# EAGLE design dc-motor (EAGLE 6.2)
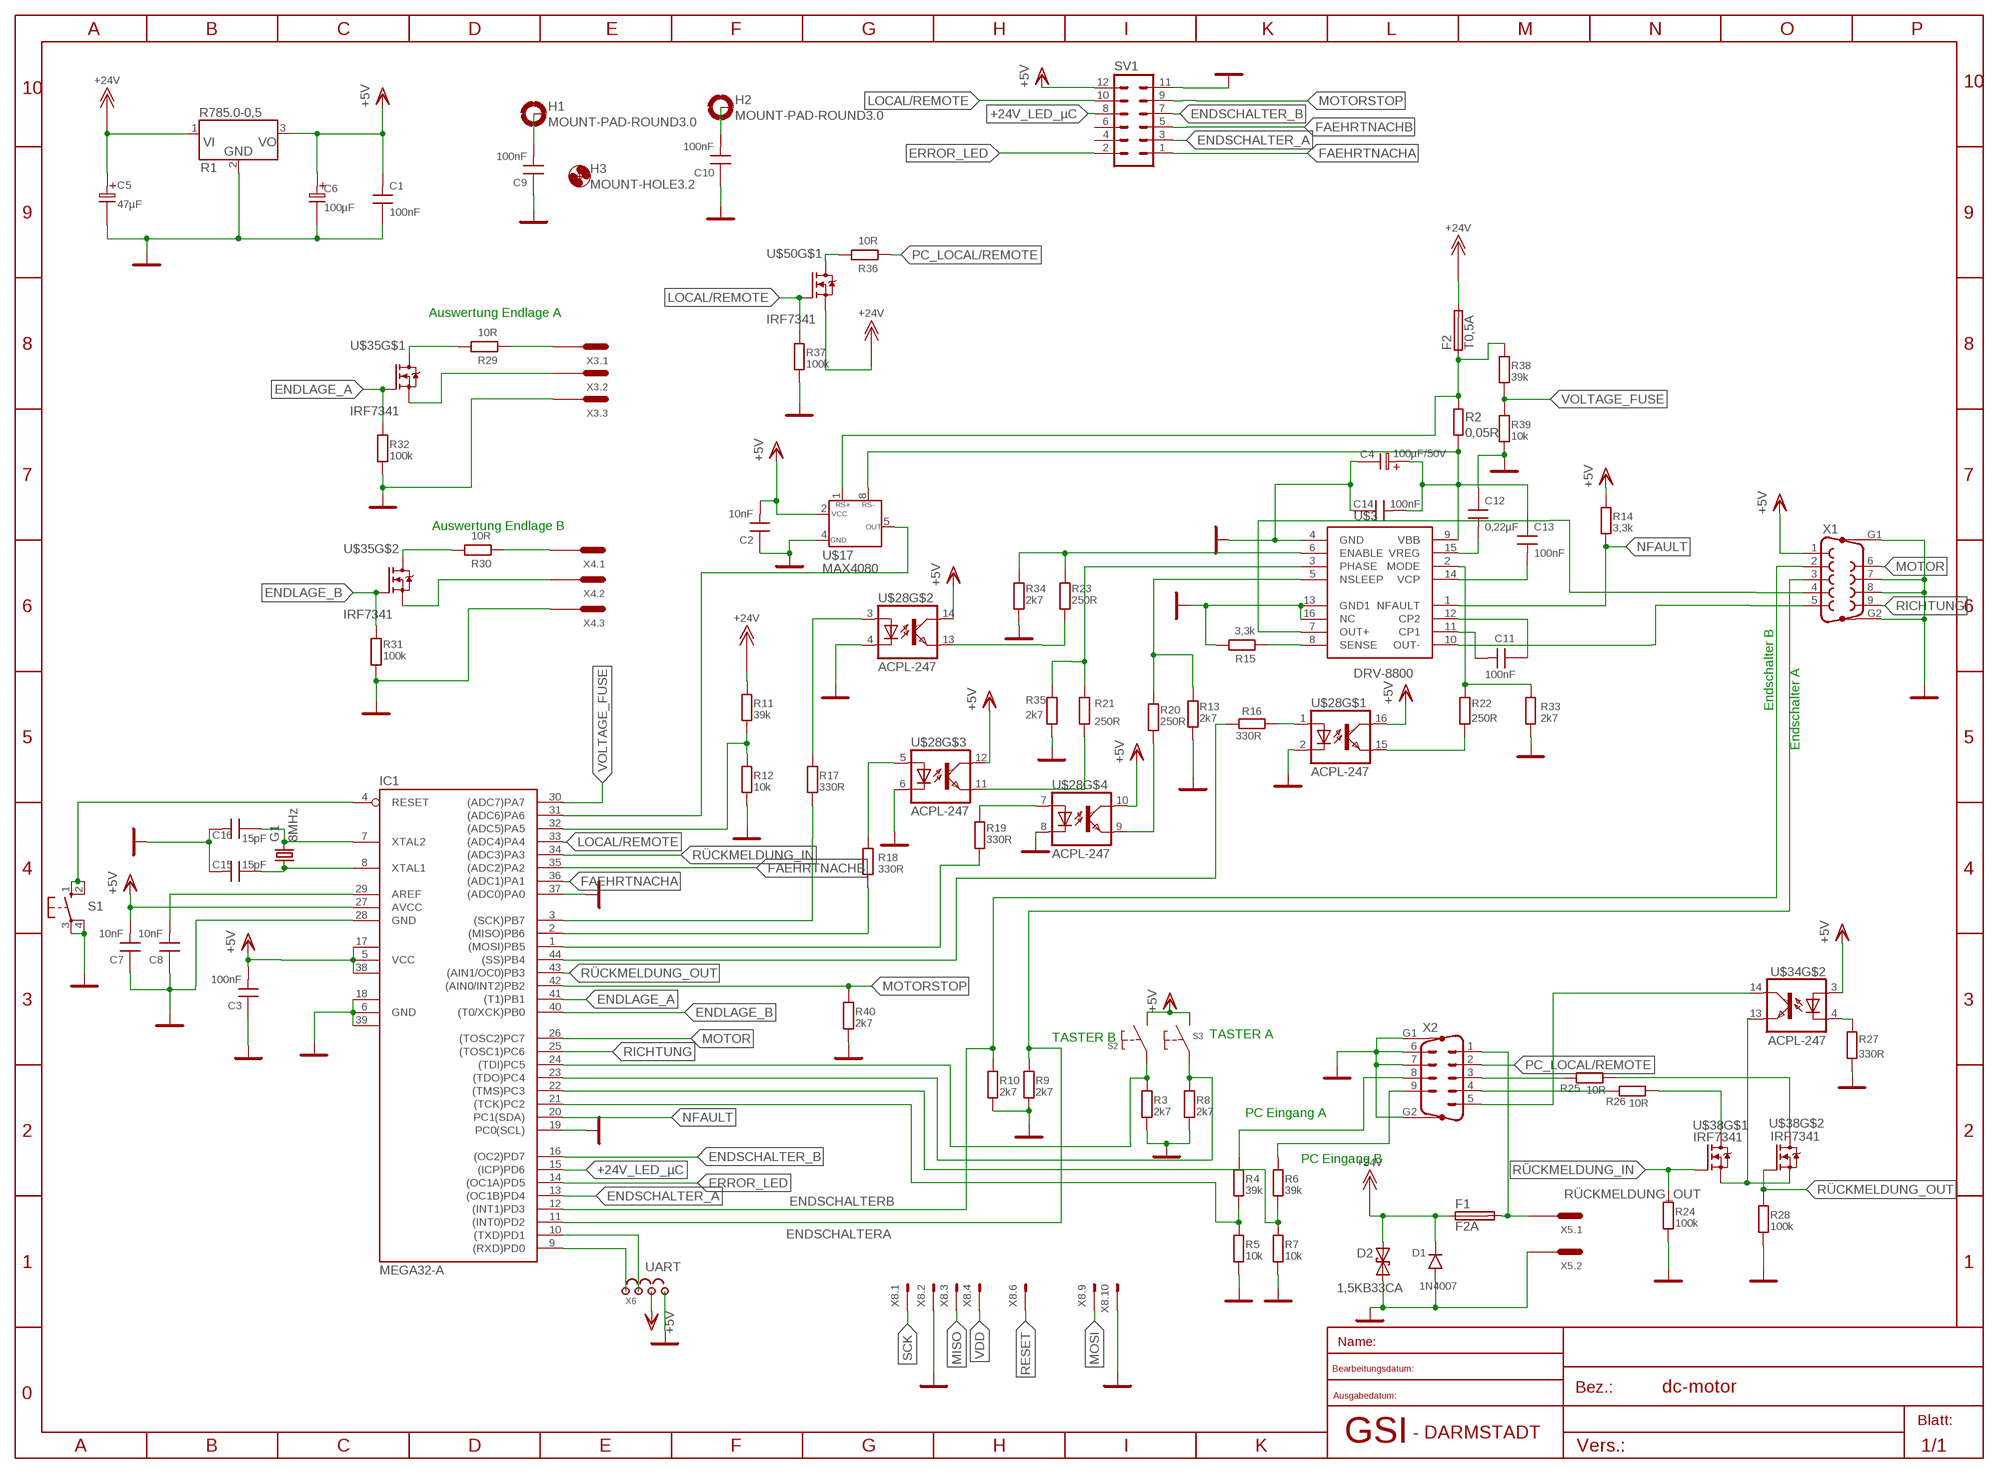
[diagram p0: schematic, sheet 1]

## Parts
C1  100nF  C-BELAB0805  [0805]
C2  10nF  C-BELAB0805  [0805]
C3  100nF  C-BELAB0805  [0805]
C4  100µF/50V  ELK_STEHEND_5_13  [E5-13]
C5  47µF  ELK_STEHEND_5_13  [E5-13]
C6  100µF  ELK_STEHEND_5_13  [E5-13]
C7  10nF  C-BELAB0805  [0805]
C8  10nF  C-BELAB0805  [0805]
C9  100nF  C-BELAB0805  [0805]
C10  100nF  C-BELAB0805  [0805]
C11  100nF  C-BELAB0805  [0805]
C12  0,22µF  C-BELAB0805  [0805]
C13  100nF  C-BELAB0805  [0805]
C14  100nF  C-BELAB0805  [0805]
C15  15pF  C-BELAB0805  [0805]
C16  15pF  C-BELAB0805  [0805]
D1  1N4007  [RM10DR1]
D2  1,5KB33CA  P6KEXXC  [CB417-15]
F1  F2A  F457  [F457]
F2  T0,5A  F457  [F457]
G1  8MHz  CRYTALHC18U-V  [HC18U-V]
H1  MOUNT-PAD-ROUND3.0  [3,0-PAD]
H2  MOUNT-PAD-ROUND3.0  [3,0-PAD]
H3  MOUNT-HOLE3.2  [3,2]
IC1  MEGA32-A  [TQFP44]
R1  R785.0-0,5  R-785.0-0.5  [SIP3]
R2  0,05R  SMS-0  [SMS-0]
R3  2k7  0805  [0805]
R4  39k  0805  [0805]
R5  10k  0805  [0805]
R6  39k  0805  [0805]
R7  10k  0805  [0805]
R8  2k7  0805  [0805]
R9  2k7  0805  [0805]
R10  2k7  0805  [0805]
R11  39k  0805  [0805]
R12  10k  0805  [0805]
R13  2k7  0805  [0805]
R14  3,3k  0805  [0805]
R15  3,3k  0805  [0805]
R16  330R  0805  [0805]
R17  330R  0805  [0805]
R18  330R  0805  [0805]
R19  330R  0805  [0805]
R20  250R  0805  [0805]
R21  250R  0805  [0805]
R22  250R  0805  [0805]
R23  250R  0805  [0805]
R24  100k  0805  [0805]
R25  10R  0805  [0805]
R26  10R  0805  [0805]
R27  330R  0805  [0805]
R28  100k  0805  [0805]
R29  10R  0805  [0805]
R30  10R  0805  [0805]
R31  100k  0805  [0805]
R32  100k  0805  [0805]
R33  2k7  0805  [0805]
R34  2k7  0805  [0805]
R35  2k7  0805  [0805]
R36  10R  0805  [0805]
R37  100k  0805  [0805]
R38  39k  0805  [0805]
R39  10k  0805  [0805]
R40  2k7  0805  [0805]
S1  10-XX  [B3F-10XX]
S2  DRUCKTASTER_ABGW  [1_POL_ABGW]
S3  DRUCKTASTER_ABGW  [1_POL_ABGW]
SV1  MA06-2  [MA06-2]
U$3  DRV-8800  [TSSOP16]
U$17  MAX4080  [MAX4080]
U$28  ACPL-247  [SOIC16]
U$34  ACPL-247  [SOIC16]
U$35  IRF7341  [SO08-IRF]
U$38  IRF7341  [SO08-IRF]
U$50  IRF7341  [SO08-IRF]
X1  F09HP  [F09HP]
X2  M09HP  [M09HP]
X3  RIA_3POL  [RIA_3POL]
X4  RIA_3POL  [RIA_3POL]
X5  RIA_2POL  [RIA_2POL]
X6  JUMP1-4  [JUMP1-4]
X8  PFVERB10  [PFVERB10]

## Nets
+24V: C5.+ D1.K D2.C F1.1 F2.2 R1.1 R11.2 U$50.1(N-S1)
+24V_LED_µC: IC1.15((ICP)PD6) SV1.8
ENDLAGE_A: IC1.41((T1)PB1) R32.1 U$35.2(N-G1)
ENDLAGE_B: IC1.40((T0/XCK)PB0) R31.1 U$35.4(N-G1)
ENDSCHALTER_A: IC1.13((OC1B)PD4) SV1.3
ENDSCHALTER_B: IC1.16((OC2)PD7) SV1.7
ENDSCHALTERA: IC1.11((INT0)PD2) R9.2 X1.3
ENDSCHALTERB: IC1.12((INT1)PD3) R10.2 X1.2
ERROR_LED: IC1.14((OC1A)PD5) SV1.2
FAEHRTNACHA: IC1.36((ADC1)PA1) SV1.1
FAEHRTNACHB: IC1.35((ADC2)PA2) SV1.5
GND: C1.1 C2.1 C3.1 C4.- C5.- C6.- C7.1 C8.1 C9.1 C10.1 C12.1 C14.1 C15.2 C16.2 D1.A D2.A IC1.6(GND) IC1.18(GND1) IC1.19(PC0(SCL)) IC1.28(GND) IC1.37((ADC0)PA0) IC1.39(GND2) R1.2 R3.1 R5.1 R7.1 R8.1 R9.1 R10.1 R12.1 R13.1 R15.2 R24.2 R27.1 R28.2 R31.2 R32.2 R33.1 R34.1 R35.1 R37.2 R39.1 R40.1 S1.3(P) S1.4(P1) SV1.11 U$3.4(GND) U$3.13(GND1) U$3.16(NC) U$17.4(GND) U$28.2(C) U$28.4(C) U$28.6(C) U$28.8(C) X1.7 X1.8 X1.G1 X1.G2 X2.6 X2.7 X2.G1 X2.G2 X3.P$3 X4.P$3 X5.P$2 X6.4 X8.2 X8.10
LOCAL/REMOTE: IC1.33((ADC4)PA4) R37.1 SV1.10 U$50.2(N-G1)
MISO: IC1.2((MISO)PB6) R18.2 X8.3
MOSI: IC1.1((MOSI)PB5) R19.1 X8.9
MOTOR: IC1.26((TOSC2)PC7) X1.6
MOTORSTOP: IC1.42((AIN0/INT2)PB2) R40.2 SV1.9
N$1: F1.2 X2.1 X5.P$1
N$2: C15.1 G1.1 IC1.8(XTAL1)
N$3: C16.1 G1.2 IC1.7(XTAL2)
N$4: IC1.9((RXD)PD0) X6.1
N$6: F2.1 R2.1 R38.2 U$17.1(RS+)
N$7: R18.1 U$28.5(A)
N$8: IC1.10((TXD)PD1) X6.2
N$9: IC1.21((TCK)PC2) R4.1 R5.2
N$10: IC1.31((ADC6)PA6) U$17.5(OUT)
N$11: IC1.22((TMS)PC3) R6.1 R7.2
N$12: R6.2 X2.9
N$13: R4.2 X2.8
N$14: R20.2 U$28.9(EMIT)
N$15: IC1.23((TDO)PC4) R8.2 S3.S1(C)
N$17: IC1.24((TDI)PC5) R3.2 S2.S1(C)
N$19: R19.2 U$28.7(A)
N$20: IC1.32((ADC5)PA5) R11.1 R12.2
N$21: C9.2 H1.B3,0(MOUNT)
N$24: C10.2 H2.B3,0(MOUNT)
N$26: C11.2 U$3.11(CP1)
N$27: C11.1 U$3.12(CP2)
N$28: C12.2 U$3.15(VREG)
N$29: C13.2 U$3.14(VCP)
N$31: R23.1 R34.2 U$3.6(ENABLE)
N$32: C4.+ C13.1 C14.2 R2.2 U$3.9(VBB) U$17.8(RS-)
N$34: R13.2 R20.1 U$3.5(NSLEEP)
N$35: R22.2 U$28.15(EMIT)
N$36: R15.1 U$3.8(SENSE)
N$37: U$34.14(COL) X2.5
N$38: IC1.44((SS)PB4) R16.1
N$39: R36.2 U$50.7(D1) U$50.8(D1)
N$40: R21.1 R35.2 U$3.3(PHASE)
N$41: U$3.7(OUT+) X1.4
N$42: R16.2 U$28.1(A)
N$43: R17.1 U$28.3(A)
N$44: U$3.10(OUT-) X1.5
N$46: R23.2 U$28.13(EMIT)
N$47: R21.2 U$28.11(EMIT)
N$48: R22.1 R33.2 U$3.2(MODE)
N$54: R26.2 X2.4
N$55: R25.2 X2.3
N$58: U$34.13(EMIT) U$38.1(N-S1) U$38.3(N-S1)
N$59: R25.1 U$38.5(D1) U$38.6(D1)
N$60: C8.2 IC1.29(AREF)
N$61: R27.2 U$34.4(C)
N$62: R26.1 U$38.7(D1) U$38.8(D1)
N$67: R29.1 X3.P$1
N$68: R30.1 X4.P$1
N$69: R30.2 U$35.5(D1) U$35.6(D1)
N$70: U$35.3(N-S1) X4.P$2
N$71: R29.2 U$35.7(D1) U$35.8(D1)
N$72: U$35.1(N-S1) X3.P$2
NFAULT: IC1.20(PC1(SDA)) R14.1 U$3.1(NFAULT)
PC_LOCAL/REMOTE: R36.1 X2.2
RESET: IC1.4(RESET) S1.1(S) S1.2(S1) X8.6
RICHTUNG: IC1.25((TOSC1)PC6) X1.9
RÜCKMELDUNG_IN: IC1.34((ADC3)PA3) R24.1 U$38.2(N-G1)
RÜCKMELDUNG_OUT: IC1.43((AIN1/OC0)PB3) R28.1 U$38.4(N-G1)
SCK: IC1.3((SCK)PB7) R17.2 X8.1
VDD: C1.2 C2.2 C3.2 C6.+ C7.2 IC1.5(VCC) IC1.17(VCC1) IC1.27(AVCC) IC1.38(VCC2) R1.3 R14.2 S2.S2(N0) S3.S2(N0) SV1.12 U$17.2(VCC) U$28.10(COL) U$28.12(COL) U$28.14(COL) U$28.16(COL) U$34.3(A) X1.1 X6.3 X8.4 ; supply symbol labelled +5V
VOLTAGE_FUSE: IC1.30((ADC7)PA7) R38.1 R39.2
Unconnected: SV1.4 SV1.6 U$34.1(A) U$34.2(C) U$34.5(A) U$34.6(C) U$34.7(A) U$34.8(C) U$34.9(EMIT) U$34.10(COL) U$34.11(EMIT) U$34.12(COL) U$34.15(EMIT) U$34.16(COL) U$50.3(N-S1) U$50.4(N-G1) U$50.5(D1) U$50.6(D1) X8.5 X8.7 X8.8

## Notes on the sheet
- Auswertung Endlage A
- Auswertung Endlage B
- Endschalter B
- Endschalter A
- TASTER B | TASTER A
- PC Eingang A
- PC Eingang B
- UART

## Library data of the parts
C1-C3 C7-C16 = Capacitor:C-BELAB
C4-C6 = Capacitor:ELK_STEHEND_5_13
D1 = Diode:1N4007
D2 = Diode:P6KEXXC: DIODE transient-voltage suppressor
F1 F2 = fuse:F457: FUSE HOLDER CS, Schukat; OC_FARNELL: unknown; OC_NEWARK: unknown
G1 = Crystals:CRYTAL: Quarze, teilw. geändert für Belab
H1 H2 = Holes:MOUNT-PAD-ROUND: MOUNTING PAD, round
H3 = Holes:MOUNT-HOLE: MOUNTING HOLE with drill center marker
IC1 = atmel:MEGA32: MICROCONTROLLER 32 Kbytes FLASH 2 Kbytes SRAM 1 Kbytes EEPROM USART 8-channel 10 bit ADC Source: www.atmel.com .. doc2503.pdf; MPN: ATMEGA32-16AU; OC_FARNELL: 9171274; OC_NEWARK: 69K6677
R1 = DC-DC-converter:R-785.0-0.5: DC-DC-Converter R-785.0-0.5 Ue/Ua 6.5-34V/ 5V 0.5A
R2 = Resistor:SMS-0: SMD SHUNT RESISTOR Hersteller: Isabellenhütte einsetzbar als Zwei-Leiter-Widerstand, Vier-Leiter-Anbindung auf dem Lötpad. Ideal geeignet für getaktete Applikationen zufolge niedriger Induktivität. Maße: L 6,35, B 3,05, H 0,7 mm, Nennbelastbarkeit: 2,0 W, Temperaturkoeffizient (TK): 50 (+20 bis +60 °C), innerer Wärmewiderstand: 25 K/W, Betriebstemperatur: ?55 bis +170 °C, Langzeitkonstanz +100 °C: 0,5 %/2000 h.
R3-R40 = Resistor:0805: SMD Widerstand
S1 = Switch:10-XX: OMRON SWITCH
S2 S3 = Switch:DRUCKTASTER
SV1 = con-lstb:MA06-2: PIN HEADER; OC_FARNELL: unknown; OC_NEWARK: unknown
U$3 = DRV-8800:DRV-8800
U$17 = Sensorics:MAX4080: MAX4080 Stromsensor 4,5V - 76V / 75µA
U$28 U$34 = Optoelectronic:ACPL-247
U$35 U$38 U$50 = Transistor:IRF7341
X1 = con-subd:F09HP: SUB-D; OC_FARNELL: unknown; OC_NEWARK: unknown
X2 = con-subd:M09HP: SUB-D; OC_FARNELL: unknown; OC_NEWARK: unknown
X3 X4 = Connector:RIA_3POL: RIA AKL230 Reichelt
X5 = Connector:RIA_2POL: RIA AKL230 Reichelt
X6 = Connector:JUMP1-4
X8 = Connector:PFVERB10

## Board
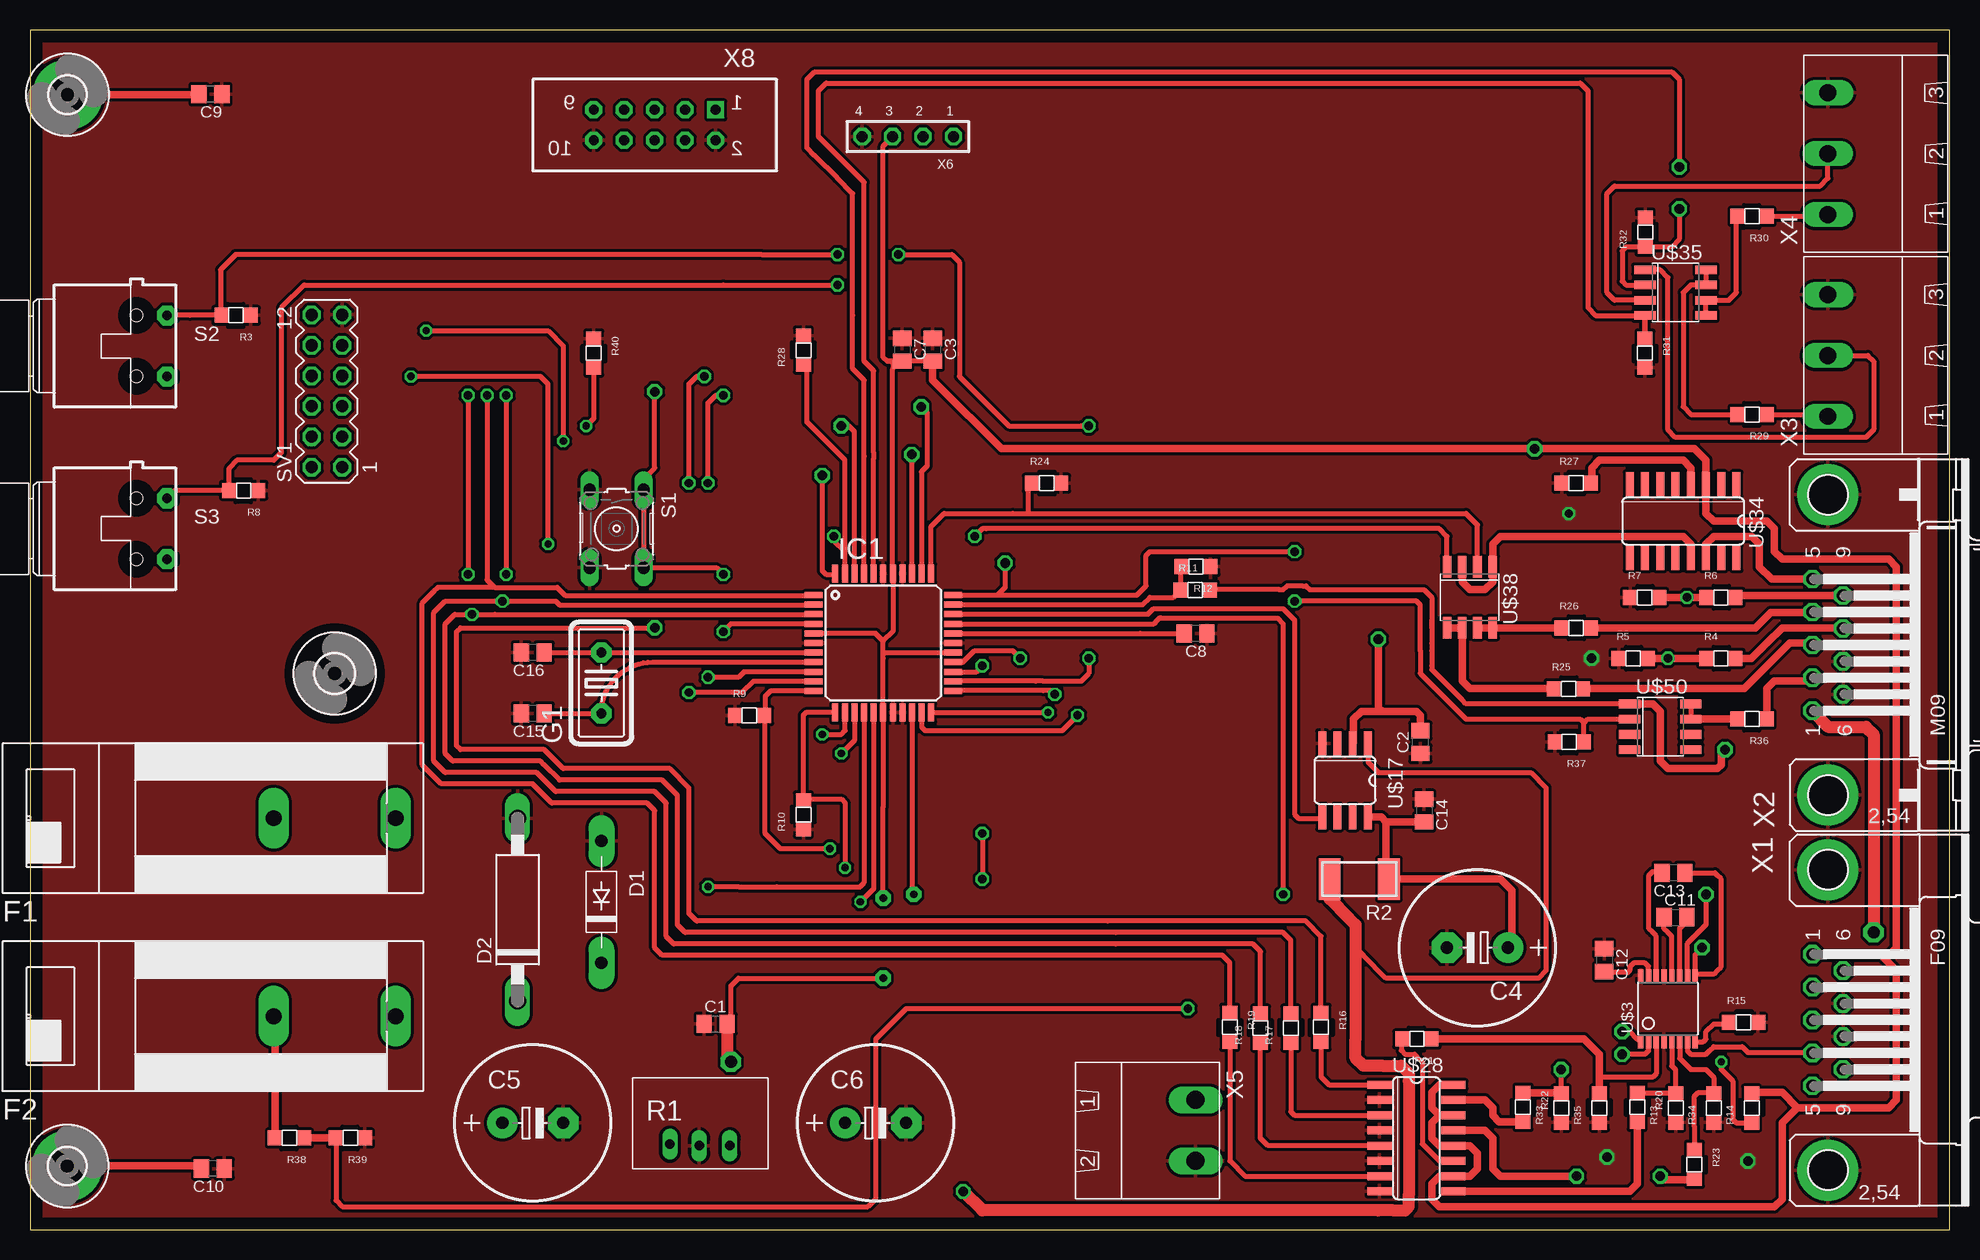
[diagram p1: board, top side]
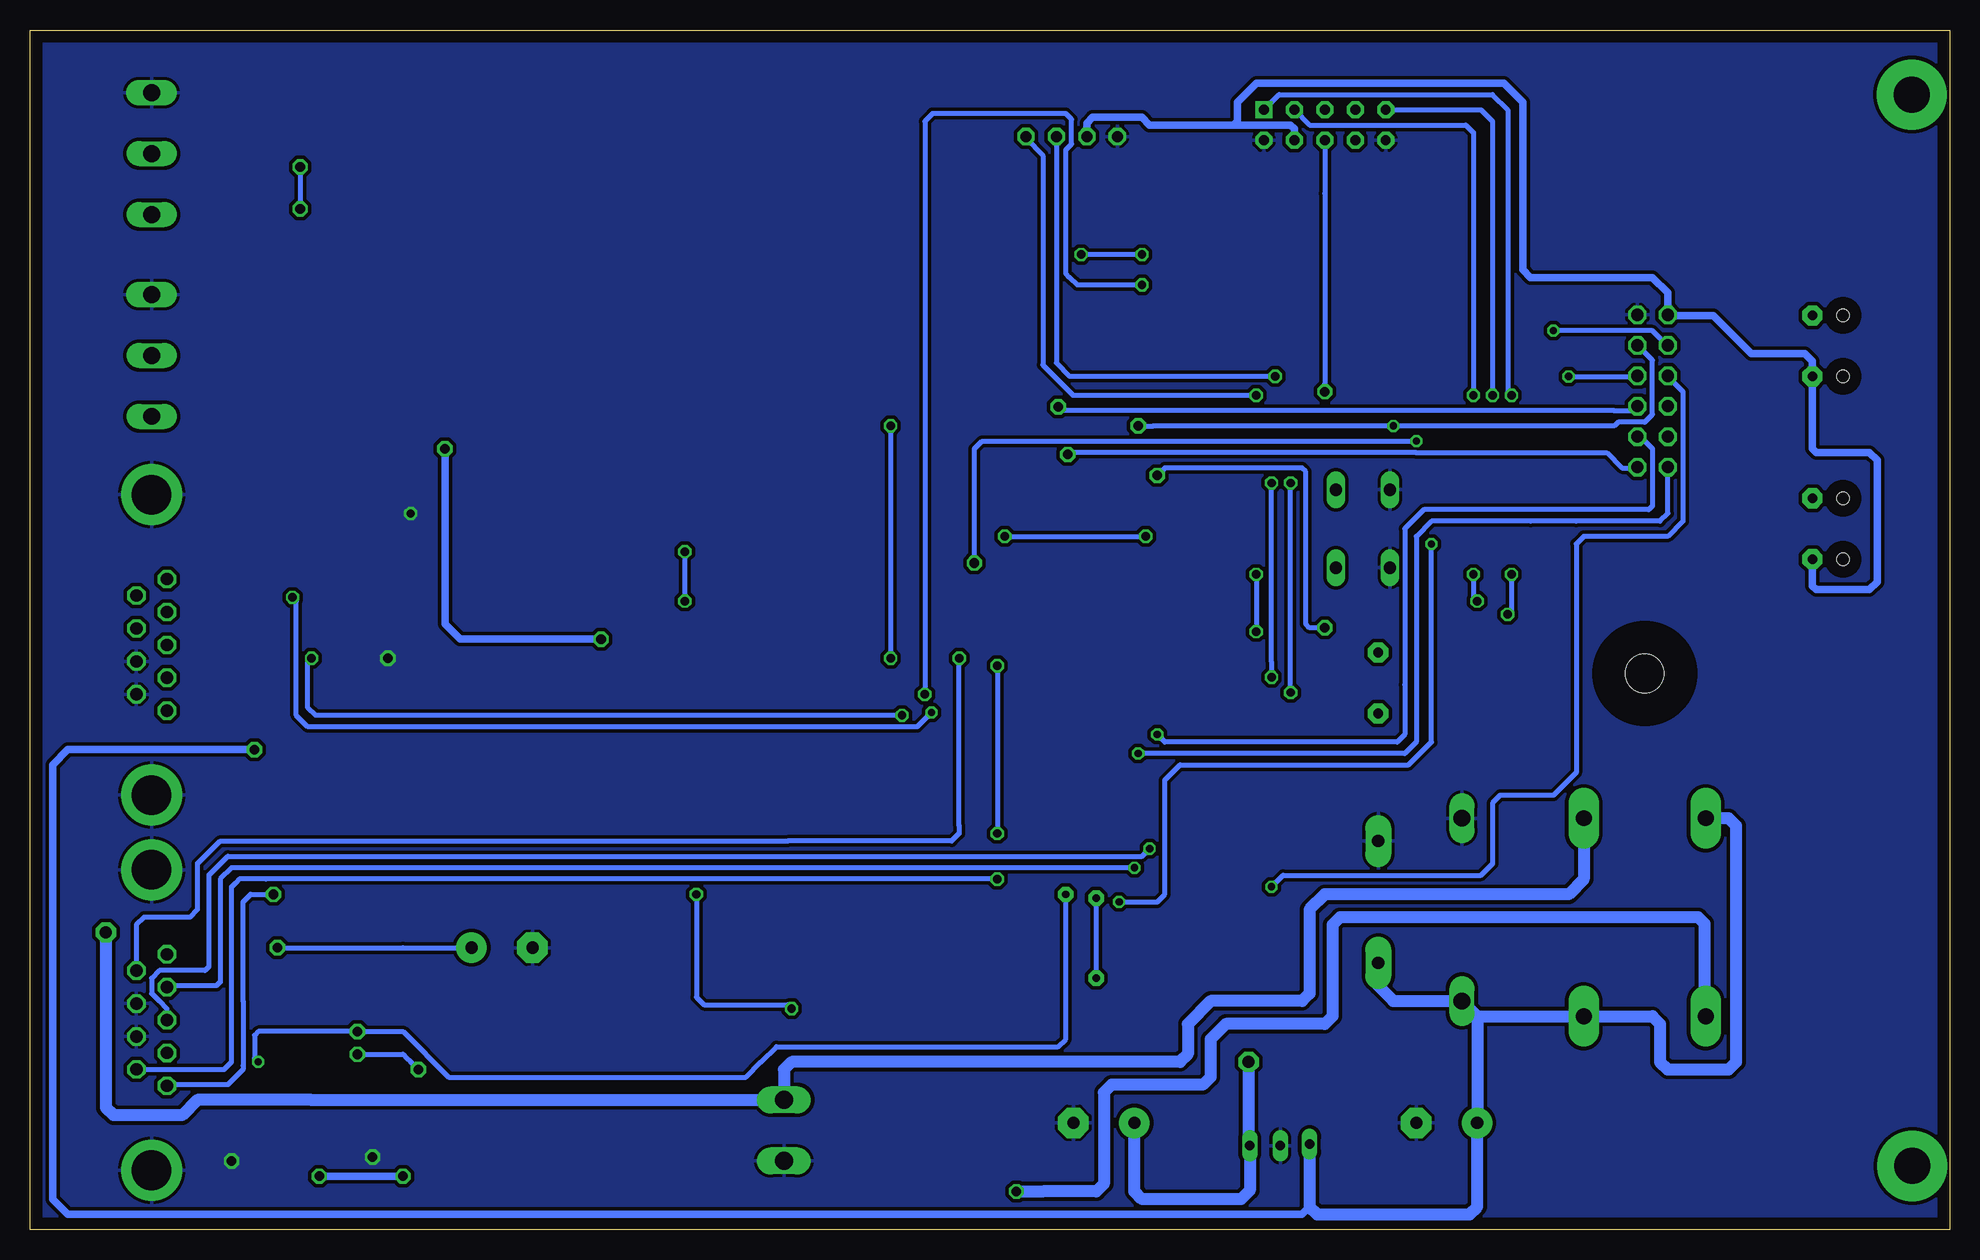
[diagram p2: board, bottom side, seen from below]

Size 160 x 100 mm. Coordinates in mm from the lower left corner, seen from the top.
Outline: 0,0 160,0 160,100 0,100 0,0
Copper layers (1+16): Top 0.035mm / dielectric 1.5mm / Bottom 0.035mm
Design rules: minimum track width 0.304mm, minimum drill 0.3mm, track to track 10mil, track to pad 10mil, pad to pad 10mil, via to via 10mil, smd to smd 8mil, copper to edge 40mil, drill to drill 20mil, minimum pad ring 10mil, minimum via ring 8mil, stop-mask expansion 4mil, vias tented up to drill 0mil, thermal gap 10mil

### Footprints (pad centres in the part's own frame; a part is rotated, then mirrored left to right if it is on the bottom)
0805 = smd 1.27 x 1.524: 1 -0.953,0; 2 0.953,0
E5-13 = drill 1.016 pad 2.54: + -2.54,0 | drill 1.016 pad 2.54 octagon: - 2.54,0
RM10DR1 = drill 1.016 pad 2.184 long: A -6.35,0; K 3.81,0
CB417-15 = drill 1.397 long: A 7.62,0; C -7.62,0
F457 = drill 1.321 pad 2.54 long: 1 -5.08,0; 2 5.08,0
HC18U-V = drill 0.813 pad 1.676 octagon: 1 -2.54,0; 2 2.54,0
3,0-PAD = drill 3 pad 5.842: B3,0 0,0
3,2 = hole 3.2: 0,0
TQFP44 = smd 1.5 x 0.5: 1 -5.8,4; 2 -5.8,3.2; 3 -5.8,2.4; 4 -5.8,1.6; 5 -5.8,0.8; 6 -5.8,0; 7 -5.8,-0.8; 8 -5.8,-1.6; 9 -5.8,-2.4; 10 -5.8,-3.2; 11 -5.8,-4; 23 5.8,-4; 24 5.8,-3.2; 25 5.8,-2.4; 26 5.8,-1.6; 27 5.8,-0.8; 28 5.8,0; 29 5.8,0.8; 30 5.8,1.6; 31 5.8,2.4; 32 5.8,3.2; 33 5.8,4 | smd 0.5 x 1.5: 12 -4,-5.8; 13 -3.2,-5.8; 14 -2.4,-5.8; 15 -1.6,-5.8; 16 -0.8,-5.8; 17 0,-5.8; 18 0.8,-5.8; 19 1.6,-5.8; 20 2.4,-5.8; 21 3.2,-5.8; 22 4,-5.8; 34 4,5.8; 35 3.2,5.8; 36 2.4,5.8; 37 1.6,5.8; 38 0.8,5.8; 39 0,5.8; 40 -0.8,5.8; 41 -1.6,5.8; 42 -2.4,5.8; 43 -3.2,5.8; 44 -4,5.8
SIP3 = drill 0.8 long: 1 0,2.035; 2 2.445,1.905; 3 4.985,1.905
SMS-0 = smd 1.8 x 3.45: 1 2.464,0; 2 -2.464,0
0805' = smd 1.2 x 1.25: 1 -0.601,0.625; 2 1.801,0.625
B3F-10XX = drill 1.016 long: 1 -3.251,2.261; 2 3.251,2.261; 3 -3.251,-2.261; 4 3.251,-2.261
1_POL_ABGW = drill 0.8 pad 1.676 octagon: S1 6.35,2.54; S2 6.35,-2.54 | hole 1.016: 3.81,-2.54; 3.81,2.54
MA06-2 = drill 1.016 octagon: 1 -6.35,-1.27; 2 -6.35,1.27; 3 -3.81,-1.27; 4 -3.81,1.27; 5 -1.27,-1.27; 6 -1.27,1.27; 7 1.27,-1.27; 8 1.27,1.27; 9 3.81,-1.27; 10 3.81,1.27; 11 6.35,-1.27; 12 6.35,1.27
TSSOP16 = smd 0.45 x 1.05: 1 -2.275,-2.768; 2 -1.625,-2.768; 3 -0.975,-2.768; 4 -0.325,-2.768; 5 0.325,-2.768; 6 0.975,-2.768; 7 1.625,-2.768; 8 2.275,-2.768; 9 2.275,2.768; 10 1.625,2.768; 11 0.975,2.768; 12 0.325,2.768; 13 -0.325,2.768; 14 -0.975,2.768; 15 -1.625,2.768; 16 -2.275,2.768
MAX4080 = smd 0.66 x 2.032: 1 -1.667,-3.057; 2 -0.397,-3.057; 3 0.873,-3.057; 4 2.143,-3.057; 5 2.143,3.089; 6 0.873,3.089; 7 -0.397,3.089; 8 -1.667,3.089
SOIC16 = smd 0.66 x 2.032: 1 -4.445,-3.073; 2 -3.175,-3.073; 3 -1.905,-3.073; 4 -0.635,-3.073; 5 0.635,-3.073; 6 1.905,-3.073; 7 3.175,-3.073; 8 4.445,-3.073; 9 4.445,3.073; 10 3.175,3.073; 11 1.905,3.073; 12 0.635,3.073; 13 -0.635,3.073; 14 -1.905,3.073; 15 -3.175,3.073; 16 -4.445,3.073
SO08-IRF = smd 0.72 x 1.78: 1 -1.905,-2.543; 2 -0.635,-2.543; 3 0.635,-2.543; 4 1.905,-2.543; 5 1.905,2.543; 6 0.635,2.543; 7 -0.635,2.543; 8 -1.905,2.543
F09HP = drill 1.016 octagon: 1 -5.486,-1.27; 2 -2.743,-1.27; 3 0,-1.27; 4 2.743,-1.27; 5 5.486,-1.27; 6 -4.115,1.27; 7 -1.372,1.27; 8 1.372,1.27; 9 4.115,1.27 | drill 3.302 pad 5.08: G1 -12.522,0; G2 12.522,0
M09HP = drill 1.016 octagon: 1 -5.486,1.27; 2 -2.743,1.27; 3 0,1.27; 4 2.743,1.27; 5 5.486,1.27; 6 -4.115,-1.27; 7 -1.372,-1.27; 8 1.372,-1.27; 9 4.115,-1.27 | drill 3.302 pad 5.08: G1 -12.522,0; G2 12.522,0
RIA_3POL = drill 1.4 long: P$1 -8.89,7.62; P$2 -3.81,7.62 | drill 1.422 long: P$3 1.27,7.62
RIA_2POL = drill 1.5 long: P$1 -2.54,0; P$2 2.54,0
JUMP1-4 = drill 0.914 pad 1.422 octagon: 1 -3.81,0; 2 -1.27,0; 3 1.27,0; 4 3.81,0
PFVERB10 = drill 0.813 pad 1.422 square: 1 -5.08,-1.27 | drill 0.813 pad 1.422 octagon: 2 -5.08,1.27; 3 -2.54,-1.27; 4 -2.54,1.27; 5 0,-1.27; 6 0,1.27; 7 2.54,-1.27; 8 2.54,1.27; 9 5.08,-1.27; 10 5.08,1.27

### Placement (x,y rotation side)
C1  57.15,17.14 0 top
C2  115.89,40.64 90 top
C3  75.25,73.34 270 top
C4  120.65,23.5 180 top
C5  41.91,8.89 0 top
C6  70.48,8.89 0 top
C7  72.71,73.34 270 top
C8  97.16,49.69 180 top
C9  15.04,94.65 180 top
C10  15.24,5.08 180 top
C11  137.16,26.04 0 top
C12  131.22,22.45 270 top
C13  136.99,29.73 180 top
C14  116.2,34.92 270 top
C15  41.91,43.02 180 top
C16  41.91,48.1 180 top
D1  47.62,26.04 270 top
D2  40.64,26.67 90 top
F1  25.4,34.29 0 top
F2  25.4,17.78 0 top
G1  47.62,45.56 90 top
H1  3.13,94.61 0 top
H2  3.1,5.29 0 top
H3  25.4,46.35 0 top
IC1  71.12,48.9 0 top
R1  53.34,5.08 0 top
R2  110.81,29.21 180 top
R3  2k7  [0805']  17.78,76.83 180 top
R4  39k  [0805']  140.34,46.99 0 top
R5  10k  [0805']  133.03,46.99 0 top
R6  39k  [0805']  140.34,52.07 0 top
R7  10k  [0805']  133.99,52.07 0 top
R8  2k7  [0805']  18.41,62.23 180 top
R9  2k7  [0805']  59.37,42.23 0 top
R10  2k7  [0805']  65.09,33.97 90 top
R11  39k  [0805']  96.52,52.7 0 top
R12  10k  [0805']  97.79,55.88 180 top
R13  2k7  [0805']  137.79,9.53 90 top
R14  3,3k  [0805']  144.15,9.53 90 top
R15  3,3k  [0805']  142.24,16.63 0 top
R16  330R  [0805']  107,17.46 270 top
R17  330R  [0805']  105.73,16.19 90 top
R18  330R  [0805']  103.19,16.19 90 top
R19  330R  [0805']  99.38,17.46 270 top
R20  250R  [0805']  133.35,10.79 270 top
R21  250R  [0805']  116.2,16.51 180 top
R22  250R  [0805']  123.83,10.79 270 top
R23  250R  [0805']  138.11,6.03 270 top
R24  100k  [0805']  84.14,61.59 0 top
R25  10R  [0805']  127.64,44.45 0 top
R26  10R  [0805']  128.27,49.53 0 top
R27  330R  [0805']  128.27,61.59 0 top
R28  100k  [0805']  65.09,72.71 90 top
R29  10R  [0805']  144.15,68.58 180 top
R30  10R  [0805']  144.15,85.09 180 top
R31  100k  [0805']  133.99,73.66 270 top
R32  100k  [0805']  135.25,82.55 90 top
R33  2k7  [0805']  128.27,9.53 90 top
R34  2k7  [0805']  140.97,9.53 90 top
R35  2k7  [0805']  131.44,9.53 90 top
R36  10R  [0805']  144.15,43.18 180 top
R37  100k  [0805']  128.91,41.27 180 top
R38  39k  [0805']  22.23,8.26 180 top
R39  10k  [0805']  27.3,8.26 180 top
R40  2k7  [0805']  46.35,73.66 270 top
S1  48.9,58.42 270 top
S2  5.08,73.66 0 top
S3  5.08,58.42 0 top
SV1  24.74,69.9 90 top
U$3  136.53,18.41 0 top
U$17  109.86,37.47 180 top
U$28  115.57,7.62 270 top
U$34  137.79,59.05 180 top
U$35  137.16,78.11 270 top
U$38  120.02,52.7 180 top
U$50  135.89,41.91 270 top
X1  149.86,17.46 270 top
X2  149.86,48.74 90 top
X3  157.48,76.68 90 top
X4  157.48,93.5 90 top
X5  97.16,8.26 270 top
X6  73.18,91.12 180 top
X8  52.07,92.08 180 top

### Tracks (layer width: path | path; a pad name or v marks a point on that pad's centre or on a via)
+24V  (via drill 0.8 pad 1.27)
  Top 0.406: 116.84,50.16 116.84,50.8 | U$50.1 124.78,43.81 119.7,43.81 119.38,44.13 118.43,45.09 117.79,45.72 116.84,46.67 116.84,46.99 116.84,48.26 116.84,48.9 116.84,50.16 | 116.84,50.16 116.84,52.7 116.22,53.33 106.69,53.33 106.68,53.34 106.36,53.66 106.05,53.66 104.78,53.66 104.46,53.34 104.14,53.34 98.33,53.34 R11.2
  Top 0.61: U$50.1 135.25,43.81 135.89,43.18 135.89,39.05 136.53,38.42 140.65,38.42 140.97,38.73 140.97,39.69 v141.29,40.01
  Bottom 0.61: 143.19,40.01 v141.29,40.01 143.19,40.01 | 143.19,40.01 156.84,40.01 158.12,38.73 158.12,2.54 156.84,1.27 53.98,1.27 53.34,1.91 R1.1
  Bottom 1.016: R1.1 53.34,1.91 52.7,1.27 40.01,1.27 39.37,1.91 C5.+ 39.37,17.78 | D1.K 47.62,20.32 46.35,19.05 D2.C 39.37,17.78 | 39.37,17.78 F2.2 24.77,17.78 24.13,17.14 24.13,13.97 23.5,13.34 18.41,13.34 17.78,13.97 17.78,33.66 18.41,34.29 F1.1
+24V_LED_µC  (via drill 0.6)
  Top 0.406: IC1.15 69.52,28.91 69.22,28.6 69.22,28.57 62.23,28.57 59.05,28.57 v56.52,28.57
  Bottom 0.406: SV1.8 23.47,71.1 22.23,69.85 22.23,59.05 23.5,57.78 30.48,57.78 31.11,57.15 31.11,38.1 33.02,36.2 37.47,36.2 38.1,35.56 38.1,30.48 38.73,29.84 39.05,29.53 55.56,29.53 v56.52,28.57
ENDLAGE_A  (via drill 0.8 pad 1.27)
  Top 0.406: IC1.41 69.52,64.44 69.53,64.45 69.53,70.8 69.22,71.12 68.58,71.75 68.58,76.2 68.58,86.36 67.31,87.63 65.41,89.53 64.77,90.17 64.77,95.89 65.41,96.52 136.84,96.52 137.48,95.89 v137.48,88.58 | v137.48,85.09 137.48,82.55 136.84,81.92 134.66,81.92 | 134.66,81.92 R32.1 | 134.66,81.92 133.03,81.92 132.72,81.6 132.72,79.06 133.03,78.74 U$35.2
  Bottom 0.406: v137.48,88.58 v137.48,85.09
ENDLAGE_B
  Top 0.406: R31.1 U$35.4 130.49,76.2 129.86,76.83 129.86,94.61 129.86,94.93 129.22,95.57 66.36,95.57 65.72,94.93 65.72,91.12 66.36,90.49 68.26,88.58 69.53,87.31 69.53,72.39 70.33,71.6 70.33,64.77 70.33,64.29 70.32,64.29 IC1.40 | R31.1 | R31.1 U$35.4
ENDSCHALTER_A  (via drill 0.6)
  Top 0.406: v66.04,41.27 67.63,41.27 67.94,41.59 67.94,43.07 IC1.13
  Bottom 0.406: SV1.3 25.77,66.09 24.77,65.09 24.77,60.33 25.08,60.01 43.81,60.01 45.4,58.42 45.4,45.4 45.4,41.27 46.04,40.64 65.41,40.64 v66.04,41.27
ENDSCHALTER_B  (via drill 0.6)
  Top 0.406: IC1.16 70.32,28.41 69.85,27.94 v69.22,27.3 | v43.18,57.15 43.18,63.5 43.18,70.48 42.55,71.12 v31.75,71.12
  Bottom 0.406: v69.22,27.3 66.04,27.3 65.41,27.94 65.41,37.47 64.14,38.73 45.09,38.73 43.18,40.64 v43.18,57.15 | v31.75,71.12 26.07,71.12 SV1.7
ENDSCHALTERA  (via drill 0.6)
  Top 0.406: IC1.11 61.72,44.9 61.28,44.45 61.28,42.96 R9.2 61.28,42.75 61.28,33.02 62.55,31.75 v66.67,31.75
  Bottom 0.406: v66.67,31.75 67.31,31.11 143.51,31.11 145.1,29.53 145.1,21.91 145.41,21.59 149.22,21.59 149.86,20.95 149.86,19.68 149.22,19.05 148.59,18.41 X1.3
ENDSCHALTERB  (via drill 0.6)
  Top 0.406: 64.69,43.09 IC1.12 64.69,43.09 | 64.69,43.09 64.45,42.86 | 64.45,42.86 64.45,35.78 R10.2 | 64.69,43.09 64.45,42.86 | 64.45,42.86 64.45,36.2 64.77,35.88 67.63,35.88 67.94,35.56 67.94,30.8 v67.94,30.16
  Bottom 0.406: v67.94,30.16 143.19,30.16 144.15,29.21 144.15,20.64 144.46,20.32 148.48,20.32 X1.2
ERROR_LED  (via drill 0.6)
  Top 0.406: IC1.14 68.72,40.78 v67.63,39.69
  Bottom 0.406: v67.63,39.69 45.4,39.69 44.45,40.64 44.45,57.78 43.18,59.05 34.92,59.05 31.11,59.05 24.13,59.05 23.5,59.69 23.47,59.71 SV1.2
FAEHRTNACHA  (via drill 0.8 pad 1.27)
  Top 0.406: IC1.36 73.52,64.59 v73.5,64.61
  Bottom 0.406: v73.5,64.61 73.34,64.77 44.45,64.77 28.57,64.77 27.3,63.5 26.07,63.5 SV1.1
FAEHRTNACHB  (via drill 0.8 pad 1.27)
  Top 0.406: v74.3,68.58 74.61,68.26 74.77,68.1 74.77,63.66 74.3,63.18 74.3,54.72 IC1.35
  Bottom 0.406: v74.3,68.58 73.98,68.26 27.94,68.26 26.38,68.26 SV1.5
GND  (via drill 0.7, 0.8 pad 1.27)
  other vias: 130.18,47.62 131.44,6.03 143.19,5.71 128.27,59.69
  pour Bottom (isolate 0.305): 0,0 160.02,0 160.02,2.54 160.02,100.33 0,100.33
  pour Top (isolate 0.1): 0,0 160.02,0 160.02,100.33 0,100.33
LOCAL/REMOTE  (via drill 0.6, 0.7 pad 1.02, 0.8 pad 1.27)
  Top 0.406: IC1.33 80.64,52.9 | 80.64,52.9 92.27,52.9 93.03,53.66 93.03,56.2 93.34,56.52 99.38,56.52 104.78,56.52 v105.41,56.52 | R37.1 129.51,42.19 | 129.51,42.19 129.86,42.55 U$50.2 | 129.51,42.19 129.51,42.26 129.22,42.55 119.7,42.55 119.06,43.18 117.47,44.77 115.89,46.35 115.89,48.26 115.89,48.58 115.89,52.07 115.57,52.39 v105.41,52.39 | v33.02,74.93 43.18,74.93 44.45,73.66 v44.45,65.72 | v81.28,55.56 81.28,53.53 80.64,52.9
  Bottom 0.406: v105.41,52.39 v105.41,56.52 | SV1.10 23.55,73.71 24.77,74.93 v33.02,74.93 | v81.28,55.56 81.28,65.09 80.64,65.72 78.11,65.72 v44.45,65.72
MISO  (via drill 0.7 pad 1.02)
  Top 0.406: R18.2 102.56,23.17 101.92,23.81 90.49,23.81 53.66,23.81 53.02,24.45 53.02,35.56 52.07,36.51 43.81,36.51 42.23,38.1 34.61,38.1 33.66,39.05 33.66,51.44 34.61,52.39 v39.37,52.39 43.81,52.39 44.13,52.07 65.3,52.07 IC1.2 | v39.69,69.53 v39.69,54.61
  Bottom 0.406: X8.3 53.34,92.08 40.32,92.08 39.69,91.44 v39.69,69.53 | v39.69,54.61 39.69,52.7 v39.37,52.39
MOSI  (via drill 0.7 pad 1.02)
  Top 0.406: R19.1 100,22.23 99.38,22.86 90.49,22.86 52.7,22.86 52.07,23.5 52.07,34.92 51.44,35.56 43.5,35.56 41.91,37.15 34.29,37.15 32.7,38.73 32.7,52.23 33.66,53.18 34,53.53 38.73,53.53 | v38.1,69.53 38.1,54.16 38.73,53.53 | 38.73,53.53 43.94,53.53 44.45,53.02 44.61,52.86 65.29,52.86 IC1.1
  Bottom 0.406: X8.9 39.05,93.34 38.1,92.39 v38.1,69.53
MOTOR  (via drill 0.7)
  Top 0.406: IC1.26 76.93,47.31 77.79,47.31 78.74,48.26 81.92,48.26 v82.55,47.62
  Bottom 0.406: v82.55,47.62 82.55,33.66 82.55,33.02 83.19,32.38 96.84,32.38 144.15,32.38 146.05,30.48 146.05,26.67 146.69,26.04 150.5,26.04 151.13,25.4 X1.6
MOTORSTOP  (via drill 0.6, 0.8 pad 1.27)
  Top 0.406: IC1.42 68.72,66.53 68.26,66.99 v67.63,66.99 | R40.2 46.98,67.62 v46.35,66.99
  Bottom 0.406: v67.63,66.99 66.36,66.99 v46.35,66.99 27.94,66.99 27.62,67.31 25.4,67.31 24.77,67.94 24.77,72.46 SV1.9
N$1  (via drill 1 pad 1.68)
  Top 1.016: X2.1 148.59,43.18 149.86,41.91 153.03,41.91 153.67,41.27 v153.67,24.77
  Bottom 1.016: F1.2 30.48,29.21 31.75,27.94 52.07,27.94 53.34,26.67 53.34,19.68 53.98,19.05 61.59,19.05 63.5,17.14 63.5,14.61 64.14,13.97 96.52,13.97 97.16,13.34 X5.P$1 105.41,10.79 106.05,10.79 136.53,10.79 146.05,10.79 147.32,9.53 153.03,9.53 153.67,10.16 v153.67,24.77
N$2
  Top 0.406: IC1.8 55.58,47.3 arc-90 55.56,47.31 51.91,47.31 arc90 G1.1 C15.1
N$3
  Top 0.406: C16.1 G1.2 60.48,48.1 60.96,48.1 IC1.7
N$4  (via drill 0.7 pad 1.02)
  Top 0.406: IC1.9 59.51,46.49 59.05,46.04 v56.52,46.04 | v56.52,62.23 56.52,68.9 57.15,69.53 v57.78,69.53
  Bottom 0.406: X6.1 76.99,90.96 75.56,89.53 75.56,72.07 73.03,69.53 v57.78,69.53 | v56.52,62.23 56.52,47.31 v56.52,46.04
N$6  (via drill 0.8 pad 1.02)
  Top 0.406: U$17.1 111.52,38.97 112.39,38.1 125.09,38.1 126.36,36.83 126.36,21.59 125.73,20.95 113.03,20.95 111.12,22.86 | 111.12,22.86 110.81,23.18 111.12,22.86 | 111.12,22.86 110.49,23.5
  Top 0.61: R38.2 20.42,17.68 F2.1
  Top 1.016: 108.34,27.55 R2.1 108.34,27.55 | 108.34,27.55 109.86,26.04 110.49,25.4 110.49,23.5 110.49,15.88 110.49,14.29 111.12,13.65 112.71,13.65 113.67,13.65 114.3,13.65 114.94,13.02 114.94,12.38 114.94,2.86 114.94,1.91 114.62,1.59 113.67,1.59 112.39,1.59 79.38,1.59 v77.79,3.17
  Bottom 1.016: 70.48,11.43 69.85,12.06 62.23,12.06 61.59,12.7 61.59,15.88 60.33,17.14 52.07,17.14 51.44,17.78 51.44,25.4 50.8,26.04 20.95,26.04 20.42,25.5 20.42,17.88 F2.1 | 70.48,11.43 70.48,3.81 | 70.48,3.81 71.12,3.17 | 71.12,3.17 75.56,3.17 v77.79,3.17 | 70.48,11.43 70.48,3.81 | 70.48,3.81 71.12,3.17
N$7
  Top 0.406: U$28.5 103.19,6.99 102.55,7.62 R18.1
N$8  (via drill 0.7 pad 1.02)
  Top 0.406: IC1.10 60.3,45.7 59.37,44.77 v54.93,44.77 | v54.93,62.23 54.93,70.48 55.56,71.12 v56.2,71.12
  Bottom 0.406: X6.2 74.45,72.23 73.34,71.12 59.05,71.12 58.42,71.12 57.15,71.12 56.52,71.12 | 56.52,71.12 v56.2,71.12 56.52,71.12 | v54.93,44.77 v54.93,62.23
N$9  (via drill 0.7 pad 1.02)
  Top 0.406: IC1.21 74.32,41.88 74.61,41.59 76.52,41.59 77.15,41.59 86.04,41.59 v87.31,42.86 | v136.53,47.61 R5.2
  Top 0.61: R5.2 v136.53,47.61 R4.1
  Bottom 0.406: v136.53,47.61 136.84,47.3 136.84,43.5 136.21,42.86 101.28,42.86 100.65,42.86 v87.31,42.86
N$10
  Top 0.406: IC1.31 92.85,51.3 93.2,51.3 93.66,51.75 100.01,51.75 104.46,51.75 105.41,50.8 105.41,34.61 105.73,34.29 107.63,34.29 U$17.5
N$11  (via drill 0.6, 0.7 pad 1.02)
  Top 0.406: v138.11,52.69 137.48,52.69 | IC1.22 84.05,43.09 v84.86,43.09
  Top 0.61: R6.1 v138.11,52.69 137.48,52.69 R7.2
  Bottom 0.406: v138.11,52.69 137.79,52.38 137.79,42.86 136.84,41.91 86.04,41.91 v84.86,43.09
N$12
  Top 0.406: 142.62,52.85 142.29,52.85 R6.2
  Top 0.61: X2.9 142.62,52.85
N$13
  Top 0.61: R4.2 143.5,47.61 144.78,48.9 146.05,50.16 151.07,50.16 X2.8
N$14
  Top 0.61: U$28.9 133.35,3.17 133.99,3.81 133.99,8.98 R20.2
N$15  (via drill 0.7 pad 1.02)
  Top 0.406: S3.S1 12.07,61.6 R8.2 16.61,63.5 17.25,64.14 20.32,64.14 20.95,64.77 20.95,76.83 22.86,78.74 57.78,78.74 v67.31,78.74 | v85.41,44.61 85.09,44.93 84.45,44.93 76.95,44.93 IC1.23
  Bottom 0.406: v67.31,78.74 72.71,78.74 73.34,79.38 73.66,79.69 73.66,90.01 73.34,90.33 73.18,90.49 73.18,92.55 73.66,93.03 84.77,93.03 85.41,92.39 85.41,45.09 v85.41,44.61
N$17  (via drill 0.7 pad 1.02)
  Top 0.406: R3.2 13.32,76.21 11.44,76.21 S2.S1 | IC1.24 76.94,45.72 83.82,45.72 84.45,45.72 87.63,45.72 88.27,46.35 v88.27,47.62 | v67.31,81.28 60.96,81.28 17.14,81.28 15.88,80.01 15.88,76.31 | v72.39,81.28 76.83,81.28 77.47,80.64 77.47,71.12 78.11,70.48 81.6,66.99 87.63,66.99 v88.27,66.99 | 15.88,76.31 R3.2 | 15.88,76.31 R3.2
  Bottom 0.406: v88.27,66.99 v88.27,47.62 | v67.31,81.28 v72.39,81.28
N$19
  Top 0.406: R19.2 100,5.73 101.28,4.45 U$28.7
N$20
  Top 0.406: IC1.32 92.73,52.09 93.34,52.7 95.27,52.7 95.3,52.7 R11.1 95.92,55.19 R12.2
N$21
  Top 0.61: H1.B3,0 14.05,94.61 C9.2
N$24
  Top 0.61: H2.B3,0 14.07,5.29 C10.2
N$26
  Top 0.406: C11.2 137.79,25.72 137.79,25.4 137.5,25.11 137.5,23.16 U$3.11
N$27
  Top 0.406: U$3.12 136.85,24.44 136.53,24.77 136.21,25.08 C11.1
N$28
  Top 0.406: U$3.15 134.9,21.95 134.62,22.23 133.67,22.23 133.35,21.91 133.35,21.59 133.19,21.43 131.29,21.43 C12.2
N$29
  Top 0.406: C13.2 135.92,29.84 135.25,29.84 134.94,29.53 134.94,25.08 135.25,24.77 135.55,24.47 U$3.14
N$31
  Top 0.406: U$3.6 137.5,14.27 137.79,13.97 138.43,13.34 139.7,13.34 140.34,12.7 140.34,11.34 | 140.34,11.34 R34.2 | R34.2 140.24,11.43 139.06,11.43 138.75,11.11 138.75,8.57 138.75,6.64 R23.1 | 140.34,11.34 R34.2
N$32  (via drill 0.8 pad 1.27)
  Top 0.406: C13.1 140.45,29.73 140.65,29.53 140.97,29.21 140.97,21.91 140.65,21.59 140.34,21.27 138.89,21.27 U$3.9 138.8,22.91 139.12,23.23 v139.38,23.5
  Top 0.61: U$17.8 112.63,34.38 113.03,33.97 | 113.03,33.97 113.03,29.45 R2.2 122.56,29.21 123.51,28.26 123.51,23.81 C4.+ | 113.03,33.97 C14.2
  Bottom 0.406: v139.38,23.5 128.91,23.5 C4.+
N$34
  Top 0.406: U$3.5 136.85,13.64 137.16,13.34 R13.2 137.1,11.4 R20.1
N$35
  Top 0.61: R22.2 122.45,8.99 121.92,9.53 121.92,10.16 121.28,10.79 U$28.15
N$36
  Top 0.406: U$3.8 139.47,15.65 139.7,15.88 139.7,16.51 140.34,17.14 141.53,17.14 R15.1
N$37
  Top 0.61: X2.5 145.17,54.22 144.15,55.24 144.15,57.15 143.51,57.78 140.34,57.78 139.7,57.15 U$34.14
N$38  (via drill 0.8 pad 1.27)
  Top 0.406: R16.1 107.62,24.46 106.36,25.72 89.85,25.72 55.56,25.72 54.93,26.35 54.93,36.83 53.34,38.42 44.45,38.42 43.18,39.69 42.86,40.01 35.88,40.01 35.56,40.32 35.56,49.85 35.88,50.16 v52.07,50.16 | 67.15,54.73 IC1.44 67.03,54.61 66.36,54.61 66.04,54.93 v66.04,62.87
  Bottom 0.406: v52.07,50.16 53.34,50.16 53.66,50.48 53.66,63.18 53.98,63.5 65.41,63.5 v66.04,62.87
N$39
  Top 0.406: U$50.8 U$50.7 138.44,42.56 139.08,42.56
  Top 0.61: R36.2 139.08,42.56
N$40
  Top 0.406: U$3.3 135.55,12.99 135.25,12.7 130.81,12.7
  Top 0.61: R21.1 129.53,15.89 130.81,14.61 130.81,12.7 R35.2
N$41
  Top 0.406: U$3.7 138.15,14.88 138.43,14.61 139.7,14.61 140.02,14.92 140.34,15.24 142.72,15.24 142.88,15.08 143.19,14.76 148.55,14.76 X1.4
N$42
  Top 0.406: R16.2 107.62,12.71 108.27,12.06 U$28.1
N$43
  Top 0.406: R17.1 105.1,9.83 105.41,9.53 U$28.3
N$44  (via drill 0.8 pad 1.27)
  Top 0.406: v139.7,27.94 139.7,25.4 138.75,24.45 138.11,23.81 138.11,21.22 U$3.10
  Bottom 0.406: X1.5 148.5,12.06 143.51,12.06 142.24,13.34 142.24,13.65 142.24,19.05 142.24,27.3 141.92,27.62 141.6,27.94 v139.7,27.94
N$46  (via drill 0.8 pad 1.27)
  Top 0.61: U$28.13 121.28,8.26 121.92,7.62 121.92,5.08 122.56,4.45 v128.91,4.45 | v135.89,4.45 136.21,4.13 138.63,4.13 R23.2
  Bottom 0.61: v128.91,4.45 v135.89,4.45
N$47
  Top 0.406: 114.3,15.78 114.3,14.92 114.62,14.61 115.41,14.61 115.57,14.45 116.05,13.97 116.05,7.14 117.47,5.71 U$28.11
  Top 0.61: 114.3,15.78 R21.2
N$48  (via drill 0.8 pad 1.27)
  Top 0.406: R33.2 127.64,13.32 v127.64,13.34 | U$3.2 134.9,14.88 134.62,14.61 v132.72,14.61
  Top 0.61: R22.1 127.58,11.4 R33.2
  Bottom 0.406: v127.64,13.34 128.27,13.97 128.59,14.29 128.91,14.61 v132.72,14.61
N$54
  Top 0.61: X2.4 148.55,51.44 145.1,51.44 143.83,50.16 131.44,50.16 130.08,50.16 R26.2
N$55
  Top 0.61: X2.3 148.43,48.9 146.69,48.9 146.05,48.26 143.51,45.72 142.88,45.09 130.81,45.09 129.45,45.09 R25.2
N$58
  Top 0.61: U$34.13 138.43,57.15 137.79,57.78 122.56,57.78 121.92,57.15 U$38.1 121.92,53.98 121.28,53.34 120.02,53.34 119.38,53.98 U$38.3
N$59
  Top 0.61: U$38.5 U$38.6 119.38,45.72 120.02,45.09 127.02,45.09 R25.1
N$60
  Top 0.406: IC1.29 92.56,49.7 C8.2
N$61
  Top 0.61: U$34.4 138.43,63.5 137.79,64.14 130.81,64.14 130.18,63.5 130.18,62.32 R27.2
N$62
  Top 0.61: R26.1 U$38.8 121.29,50.15 121.28,50.16 | U$38.8 121.28,50.16 | 121.28,50.16 U$38.7
N$67
  Top 0.406: R29.1 149.69,67.96 X3.P$1
N$68
  Top 0.406: R30.1 149.71,84.47 X4.P$1
N$69
  Top 0.406: U$35.5 U$35.6 141.6,77.47 142.24,78.11 142.24,84.36 R30.2
N$70
  Top 0.406: U$35.3 132.08,77.47 131.44,78.11 131.44,86.36 132.08,87 149.22,87 149.86,87.63 X4.P$2
N$71
  Top 0.406: U$35.8 U$35.7 138.43,78.74 137.79,78.11 137.79,68.59 138.43,67.95 R29.2
N$72
  Top 0.406: X3.P$2 153.19,72.87 153.67,72.39 153.67,66.67 153.03,66.04 137.16,66.04 136.53,66.67 136.53,79.38 135.89,80.01 U$35.1
NFAULT  (via drill 0.6, 0.6 pad 1.27, 0.8 pad 1.27)
  Top 0.406: U$3.1 134.21,15.65 133.99,15.88 133.35,16.51 v132.72,16.51 | R14.1 143.49,8.89 142.24,8.89 141.92,9.21 141.92,12.38 140.97,13.34 v140.97,13.97 | IC1.20 73.52,28.08 v73.66,27.94
  Bottom 0.406: v140.97,13.97 141.29,14.29 141.29,16.19 140.97,16.51 v132.72,16.51 128.91,16.51 125.09,12.7 100.33,12.7 99.06,13.97 97.79,15.24 74.3,15.24 73.66,15.88 v73.66,27.94
PC_LOCAL/REMOTE
  Top 0.61: X2.2 148.32,45.72 145.41,45.72 144.79,45.1 144.79,42.6 R36.1
RESET  (via drill 0.7 pad 1.02, 0.8 pad 1.27)
  Top 0.406: IC1.4 59.37,50.49 58.43,50.49 v57.78,49.85 | v57.78,54.61 57.23,55.17 S1.2 S1.1 51.16,62.59 52.07,63.5 v52.07,69.85
  Bottom 0.406: X8.6 52.07,86.36 52.07,70.48 v52.07,69.85 | v57.78,54.61 v57.78,49.85
RICHTUNG  (via drill 0.7)
  Top 0.406: IC1.25 78.88,46.49 v79.38,46.99 | v79.38,33.02 v79.38,29.21
  Bottom 0.406: X1.9 143.81,13.35 143.19,13.97 143.19,28.57 142.88,28.89 142.56,29.21 140.34,29.21 v79.38,29.21 | v79.38,46.99 v79.38,33.02
RÜCKMELDUNG_IN
  Top 0.406: U$38.2 120.65,58.74 119.7,59.69 83.19,59.69 | IC1.34 75.12,58.61 75.56,59.05 76.2,59.69 81.92,59.69 83.19,59.69 | R24.1 83.54,61.95 83.19,61.59 83.19,59.69
RÜCKMELDUNG_OUT  (via drill 0.7)
  Top 0.406: U$38.4 118.11,57.78 117.47,58.42 79.69,58.42 79.38,58.42 v78.74,57.78 | IC1.43 67.92,56.52 | 67.92,56.52 67.92,57.15 67.92,64.16 64.77,67.31 64.77,71.8 | 64.77,71.8 R28.1 64.77,71.8 | v66.99,57.78 66.99,57.44 67.92,56.52
  Bottom 0.406: v78.74,57.78 v66.99,57.78
SCK  (via drill 0.7 pad 1.02)
  Top 0.406: 65.3,51.28 IC1.3 65.3,51.28 | R17.2 105.1,24.12 104.46,24.77 90.49,24.77 54.61,24.77 53.98,25.4 53.98,36.2 52.7,37.47 44.13,37.47 42.86,38.73 42.55,39.05 35.24,39.05 34.61,39.69 34.61,50.48 35.24,51.12 35.4,51.28 v36.83,51.28 | v36.83,51.28 38.73,51.28 | v36.51,69.53 v36.51,54.61 | v36.83,51.28 38.73,51.28 | 38.73,51.28 65.3,51.28
  Bottom 0.406: X8.1 56.2,94.3 55.88,94.61 38.1,94.61 36.83,93.34 36.83,69.85 v36.51,69.53 | v36.51,54.61 36.51,52.86 36.51,51.59 v36.83,51.28
VDD  (via drill 0.6 pad 1.27, 0.8 pad 1.27, 1 pad 1.68)
  Top 0.406: C3.2 C7.2 71.44,72.39 | C1.2 58.42,17.46 58.42,20.32 59.05,20.95 v71.12,20.95 | v71.12,27.62 71.12,35.24 IC1.17 71.12,47.62 | 71.12,47.62 71.12,47.94 71.28,48.1 IC1.27 | 71.12,47.62 71.12,49.05 | 71.12,49.05 70.48,49.69 IC1.5 | 71.12,49.05 71.92,49.85 IC1.38 71.91,71.75 71.92,71.75 71.92,72.24 71.77,72.39 71.44,72.39 | 71.44,72.39 71.12,72.71 71.12,90.33 X6.3
  Top 0.61: U$34.3 139.7,59.69 | 139.7,59.69 140.34,59.05 144.78,59.05 145.41,58.42 145.41,56.52 146.05,55.88 154.94,55.88 155.57,55.24 155.57,23.5 154.94,22.86 148.68,22.86 | 148.68,22.86 X1.1 | 148.68,22.86 154.31,22.86 155.57,21.59 155.57,10.79 154.94,10.16 147.32,10.16 | 147.32,10.16 146.05,11.43 143.62,11.43 R14.2 | U$28.16 117.47,12.06 116.84,11.43 116.84,10.16 117.47,9.53 | 117.47,9.53 U$28.14 117.47,9.53 | 117.47,9.53 116.84,8.89 116.84,7.62 117.47,6.99 | 117.47,6.99 U$28.12 117.47,6.99 | 117.47,6.99 120.02,6.99 120.65,6.35 120.65,5.08 120.02,4.45 U$28.10 | U$28.10 118.11,4.45 | 118.11,4.45 117.47,4.45 116.84,3.81 116.84,2.54 117.47,1.91 145.41,1.91 146.05,2.54 146.05,8.89 146.69,9.53 147.32,10.16 | U$28.10 118.11,4.45 | C2.2 115.89,42.86 115.57,43.18 | 115.57,43.18 110.97,43.18 110.33,42.55 110.33,40.6 U$17.2 | 139.7,59.69 139.7,64.14 138.75,65.09 v125.41,65.09 | v125.41,65.09 124.78,65.09 | 124.78,65.09 120.97,65.09 80.96,65.09 75.56,70.48 75.25,70.8 C3.2 | 115.57,43.18 112.71,43.18 112.39,43.5 v112.39,49.21 | v125.41,65.09 124.78,65.09
  Top 1.016: C1.2 58.1,14.29 v58.42,13.97
  Bottom 0.406: v71.12,20.95 v71.12,27.62
  Bottom 0.61: S3.S2 11.43,53.66 11.11,53.34 6.67,53.34 6.03,53.98 6.03,64.14 6.67,64.77 11.11,64.77 11.43,65.09 S2.S2 11.43,72.39 12.06,73.03 16.51,73.03 17.14,73.66 19.05,75.56 19.68,76.2 23.42,76.2 SV1.12 23.5,76.27 23.5,78.11 24.77,79.38 34.92,79.38 35.56,80.01 35.56,93.98 37.15,95.57 57.78,95.57 58.1,95.25 59.37,93.98 59.37,92.39 59.69,92.08 | X6.3 71.91,92.23 71.44,92.71 67.31,92.71 66.67,92.08 59.69,92.08 | 59.69,92.08 54.93,92.08 54.61,91.76 X8.4 | v112.39,49.21 124.14,49.21 125.41,50.48 v125.41,65.09
  Bottom 1.016: C6.+ 67.94,3.17 67.31,2.54 59.05,2.54 58.33,3.27 R1.3 58.42,7.08 v58.42,13.97
VOLTAGE_FUSE  (via drill 0.7 pad 1.02)
  Top 0.406: IC1.30 93.67,50.49 | 93.67,50.49 93.98,50.8 | 93.98,50.8 94.14,50.96 | 94.14,50.96 94.3,50.96 | 94.3,50.96 99.38,50.96 | R39.2 25.5,2.44 26.04,1.91 69.85,1.91 70.48,2.54 70.48,15.88 73.03,18.41 v96.52,18.41 | 94.3,50.96 94.14,50.96 | 94.14,50.96 93.98,50.8 | 93.98,50.8 93.67,50.49 | 93.67,50.49 93.98,50.8 | 93.98,50.8 94.14,50.96 | 94.14,50.96 103.98,50.96 104.46,50.48 v104.46,27.94
  Top 0.61: R38.1 R39.2
  Bottom 0.406: v104.46,27.94 104.46,19.37 103.82,18.73 96.84,18.73 v96.52,18.41